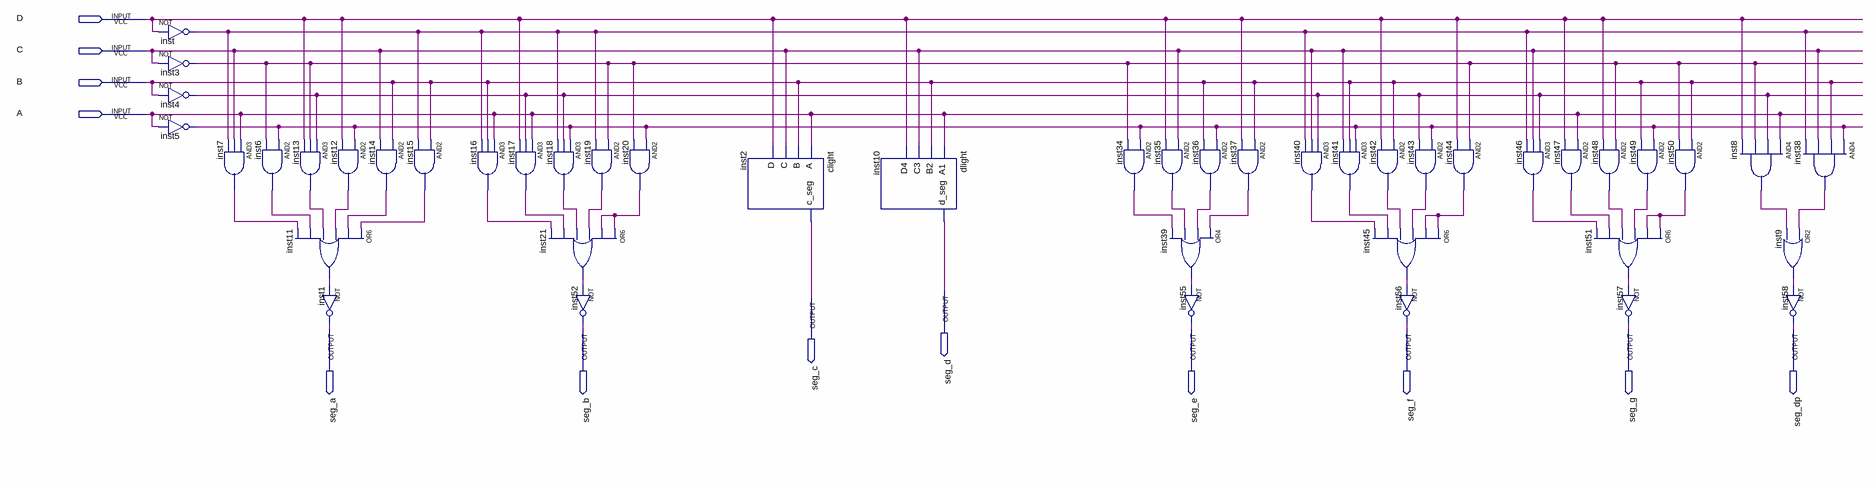
[diagram p0: schematic sheet]
// Quartus schematic 7seg.bdf as structural Verilog: 45 symbols, 12 pins
module \7seg  (
  input  D,
  input  C,
  input  B,
  input  A,
  output seg_d,
  output seg_c,
  output seg_a,
  output seg_b,
  output seg_e,
  output seg_f,
  output seg_g,
  output seg_dp
);

  wire inst3_out, inst4_out, inst5_out, inst6_out, inst7_out, inst8_out, inst9_out, inst11_out, inst12_out,
       inst13_out, inst14_out, inst15_out, inst16_out, inst17_out, inst18_out, inst19_out, inst20_out,
       inst21_out, inst34_out, inst35_out, inst36_out, inst37_out, inst38_out, inst39_out, inst40_out,
       inst41_out, inst42_out, inst43_out, inst44_out, inst45_out, inst46_out, inst47_out, inst48_out,
       inst49_out, inst50_out, inst51_out, inst_out;

  not inst (inst_out, D);
  not inst3 (inst3_out, C);
  not inst4 (inst4_out, B);
  not inst5 (inst5_out, A);
  and inst6 (inst6_out, inst5_out, inst3_out);
  and inst7 (inst7_out, A, C, inst_out);
  and inst13 (inst13_out, inst4_out, inst3_out, D);
  or inst11 (inst11_out, inst15_out, inst14_out, inst12_out, inst13_out, inst6_out, inst7_out);
  and inst12 (inst12_out, inst5_out, D);
  not inst1 (seg_a, inst11_out);
  and inst14 (inst14_out, B, C);
  and inst15 (inst15_out, B, inst_out);
  and inst16 (inst16_out, A, B, inst_out);
  and inst17 (inst17_out, A, inst4_out, D);
  and inst18 (inst18_out, inst5_out, inst4_out, inst_out);
  or inst21 (inst21_out, inst20_out, inst20_out, inst19_out, inst18_out, inst17_out, inst16_out);
  and inst19 (inst19_out, inst3_out, inst_out);
  not inst52 (seg_b, inst21_out);
  and inst20 (inst20_out, inst5_out, inst3_out);
  clight inst2 (.A(A), .B(B), .C(C), .D(D), .c_seg(seg_c));
  dlight inst10 (.A1(A), .B2(B), .C3(C), .D4(D), .d_seg(seg_d));
  and inst34 (inst34_out, inst5_out, inst3_out);
  and inst35 (inst35_out, C, D);
  or inst39 (inst39_out, inst37_out, inst36_out, inst35_out, inst34_out);
  and inst36 (inst36_out, inst5_out, B);
  not inst55 (seg_e, inst39_out);
  and inst37 (inst37_out, B, D);
  and inst40 (inst40_out, inst4_out, C, inst_out);
  and inst41 (inst41_out, inst5_out, B, C);
  and inst42 (inst42_out, B, D);
  or inst45 (inst45_out, inst44_out, inst44_out, inst43_out, inst42_out, inst41_out, inst40_out);
  and inst43 (inst43_out, inst5_out, inst4_out);
  not inst56 (seg_f, inst45_out);
  and inst44 (inst44_out, inst3_out, D);
  and inst46 (inst46_out, inst4_out, C, inst_out);
  and inst47 (inst47_out, A, D);
  and inst48 (inst48_out, inst3_out, D);
  and inst49 (inst49_out, inst5_out, B);
  or inst51 (inst51_out, inst50_out, inst50_out, inst49_out, inst48_out, inst47_out, inst46_out);
  not inst57 (seg_g, inst51_out);
  and inst50 (inst50_out, B, inst3_out);
  and inst8 (inst8_out, A, inst4_out, inst3_out, D);
  or inst9 (inst9_out, inst38_out, inst8_out);
  not inst58 (seg_dp, inst9_out);
  and inst38 (inst38_out, inst5_out, B, C, inst_out);
endmodule
